# EAGLE design ESPArmedButton-1.0 (EAGLE 9.2.2)
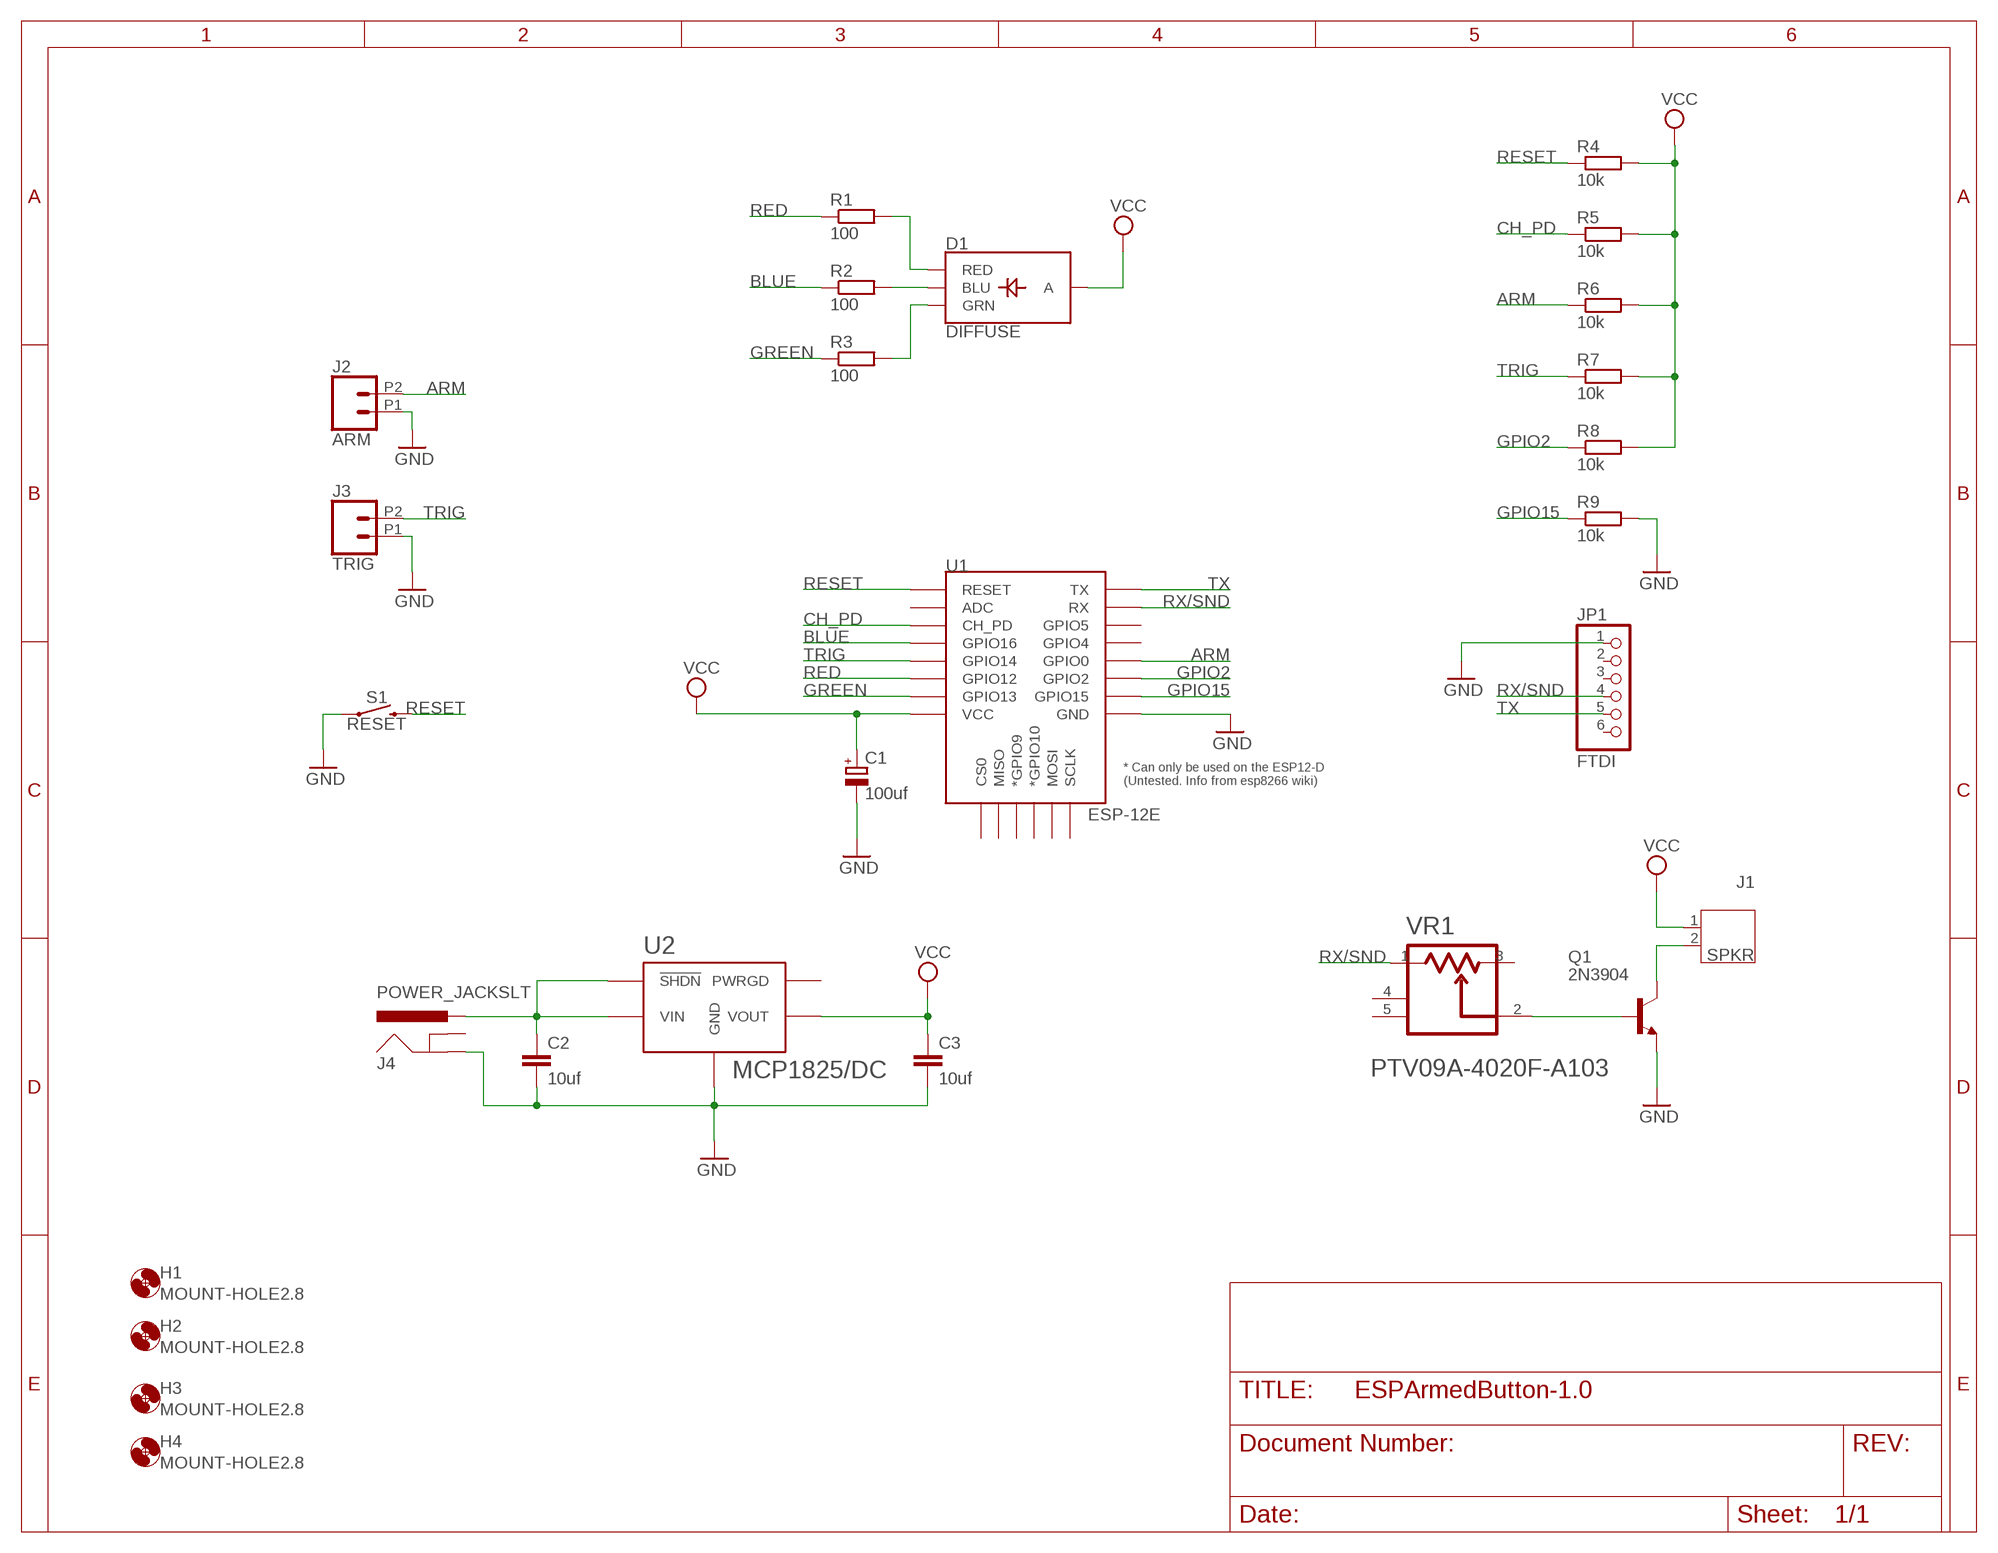
[diagram p0: schematic, sheet 1]

## Parts
C1  100uf  CPOL-EUE2-5  [E2-5]
C2  10uf  C-EU050-025X075  [C050-025X075]
C3  10uf  C-EU050-025X075  [C050-025X075]
D1  DIFFUSE  LED-RGB-CADIFFUSE  [LED-RGB-THRU]
H1  MOUNT-HOLE2.8  [2,8]
H2  MOUNT-HOLE2.8  [2,8]
H3  MOUNT-HOLE2.8  [2,8]
H4  MOUNT-HOLE2.8  [2,8]
J1  SPKR  JST-PH2  [JST-PH2]
J2  ARM  CONN_022.54MM_SCREWTERM  [1X02_2.54_SCREWTERM]
J3  TRIG  CONN_022.54MM_SCREWTERM  [1X02_2.54_SCREWTERM]
J4  POWER_JACKSLT  [POWER_JACK_SLOT]
JP1  FTDI  PINHD-1X6/90  [1X06/90]
Q1  2N3904  [TO92]
R1  100  R-EU_0207/7  [0207/7]
R2  100  R-EU_0207/7  [0207/7]
R3  100  R-EU_0207/7  [0207/7]
R4  10k  R-EU_0207/7  [0207/7]
R5  10k  R-EU_0207/7  [0207/7]
R6  10k  R-EU_0207/7  [0207/7]
R7  10k  R-EU_0207/7  [0207/7]
R8  10k  R-EU_0207/7  [0207/7]
R9  10k  R-EU_0207/7  [0207/7]
S1  RESET  MOMENTARY-SWITCH-SPST-PTH-6.0MM  [TACTILE_SWITCH_PTH_6.0MM]
U1  ESP-12E  ESP12ESMD  [ESP12E-SMD]
U2  MCP1825/DC  [SOT-223-5]
VR1  BOURNS_PTV09A-4020F-A103BOURNS_PTV09A-4020F-A103_0_0  [BOURNS_PTV09A-4020F-A103_0]

## Nets
ARM: J2.P2 R6.1 U1.GPIO0
BLUE: R2.1 U1.GPIO16
CH_PD: R5.1 U1.CH_PD
GND [power]: C1.- C2.2 C3.2 J2.P1 J3.P1 J4.GND@1(GND) JP1.1 Q1.3(E) R9.2 S1.1 U1.GND U2.P$3(GND) U2.P$6(GND)
GPIO2: R8.1 U1.GPIO2
GPIO15: R9.1 U1.GPIO15
GREEN: R3.1 U1.GPIO13
N$4: Q1.2(B) VR1.2
N$5: J1.2 Q1.1(C)
N$6: D1.4(BLU) R2.2
N$7: D1.1(RED) R1.2
N$8: D1.3(GRN) R3.2
RED: R1.1 U1.GPIO12
RESET: R4.1 S1.3 U1.RESET
RX/SND: JP1.4 U1.RXD0(RX) VR1.1
TRIG: J3.P2 R7.1 U1.GPIO14
TX: JP1.5 U1.TXD0(TX)
VCC [power]: C1.+ C3.1 D1.2(A) J1.1 R4.2 R5.2 R6.2 R7.2 R8.2 U1.VCC U2.P$4(VOUT)
VIN [power]: C2.1 J4.PWR U2.P$1(!SHDN) U2.P$2(VIN)
Unconnected: J4.GND@2(GNDBREAK) JP1.2 JP1.3 JP1.6 U1.ADC U1.CS0 U1.GPIO4 U1.GPIO5 U1.GPIO9(*GPIO9) U1.GPIO10(*GPIO10) U1.MISO U1.MOSI U1.SCLK U2.P$5(PWRGD) VR1.3 VR1.4(MNT_1) VR1.5(MNT_2)

## Library data of the parts
C1 = resistor:CPOL-EU: POLARIZED CAPACITOR, European symbol
C2 C3 = rcl:C-EU: CAPACITOR, European symbol; SPICEPREFIX: C
D1 = LED:LED-RGB-CA: LED-RGB Diffused Common Anode Packages: LED RGB-THRU P-LCC-4-3 LED-TRICOLOR-SMD SparkFun Products: RGB Diffused Common Anode- Diffuse <[https://www.sparkfun.com/products/10821]> RGB Diffused Common Anode - Clear <[https://www.sparkfun.com/products/10820]> Qduino Mini <[https://www.sparkfun.com/products/13614]> Triple Output LED RGB - SMD <https://www.sparkfun.com/products/7844>; PROD_ID: DIO-10632
H1-H4 = holes:MOUNT-HOLE: MOUNTING HOLE with drill center marker
J1 = jst-ph:JST-PH2
J2 J3 = SparkFun-Connectors:CONN_02: Multi connection point. Often used as Generic Header-pin footprint for 0.1 inch spaced/style header connections On any of the 0.1 inch spaced packages, you can populate with these: Break Away Headers - Straight <https://www.sparkfun.com/products/116> (PRT-00116) Break Away Male Headers - Right Angle <https://www.sparkfun.com/products/553> (PRT-00553) Female Headers <https://www.sparkfun.com/products/115> (PRT-00115) Break Away Headers - Machine Pin <https://www.sparkfun.com/products/117> (PRT-00117) Break Away Female Headers - Swiss Machine Pin <https://www.sparkfun.com/products/743> (PRT-00743) For SCREWTERMINALS and SPRING TERMINALS visit here: Screw Terimnals on SparkFun.com <https://www.sparkfun.com/search/results?term=Screw+Terminals> (5mm/3.5mm/2.54mm spacing) This device is also useful as a general connection point to wire up your design to another part of your project. Our various solder wires solder well into these plated through hole pads. Hook-Up Wire - Assortment (Stranded, 22 AWG) <https://www.sparkfun.com/products/11375> (PRT-11375) Hook-Up Wire - Assortment (Solid Core, 22 AWG) <https://www.sparkfun.com/products/11367> (PRT-11367) View the entire wire category on our website here <https://www.sparkfun.com/categories/141> Special notes: Molex polarized connector foot print use with: PRT-08233 with associated crimp pins and housings. 2.54_SCREWTERM for use with PRT-10571. 3.5mm Screw Terminal footprints for PRT-08084 5mm Screw Terminal footprints for use with PRT-08432
J4 = powerjack:POWER_JACK: Power Jack Connector This is the standard 5.5mm barrel jack for power. The PTH is the most common, proven, reliable, footprint. The Slot footprint only works if the mill layer is transmitted to the PCB fab house so be warned. Here are the connectors we sell at SparkFun: DC Barrel Power Jack/Connector <https://www.sparkfun.com/products/119> (PRT-00119) DC Barrel Power Jack/Connector (SMD) <https://www.sparkfun.com/products/12748> (PRT-12748) DC Barrel Jack Adapter - Breadboard Compatible <https://www.sparkfun.com/products/10811> (PRT-10811) It is used on this SparkFun product (and many, many others): SparkFun RedBoard - Programmed with Arduino <https://www.sparkfun.com/products/12757> (DEV-12757) Also, if you need a mating power supply or connector, please check these out: Wall Adapter Power Supply - 9VDC 650mA <https://www.sparkfun.com/products/298> (TOL-00298) DC Barrel Jack Adapter - Male <https://www.sparkfun.com/products/10287> (PRT-10287); PROD_ID: PRT-00119
JP1 = pinhead:PINHD-1X6: PIN HEADER
Q1 = transistor-npn:2N3904: NPN Transistor
R1-R9 = resistor:R-EU_: RESISTOR, European symbol
S1 = switches:MOMENTARY-SWITCH-SPST: Momentary Switch (Pushbutton) - SPST Normally-open (NO) SPST momentary switches (buttons, pushbuttons). Variants PTH-12MM - 12mm square, through-hole Momentary Pushbutton Switch - 12mm Square <https://www.sparkfun.com/products/9190> (COM-09190) PTH-6.0MM, PTH-6.0MM-KIT - 6.0mm square, through-hole Mini Pushbutton Switch <https://www.sparkfun.com/products/97> (COM-00097) KIT package intended for soldering kit's - only one side of pads' copper is exposed. PTH-RIGHT-ANGLE-KIT - Right-angle, through-hole Right Angle Tactile Button <https://www.sparkfun.com/products/10791> - Used on SparkFun BigTime Watch Kit <https://www.sparkfun.com/products/11734> SMD-12MM - 12mm square, surface-mount Tactile Button - SMD (12mm) <https://www.sparkfun.com/products/12993> (COM-12993) Used on SparkFun PicoBoard <https://www.sparkfun.com/products/11888> SMD-4.5MM - 4.5mm Square Trackball Switch Used on SparkFun Blackberry Trackballer Breakout <https://www.sparkfun.com/products/13169> SMD-4.6MMX2.8MM - 4.60mm x 2.80mm, surface mount Used on SparkFun SAMD21 Mini Breakout <https://www.sparkfun.com/products/13664> SMD-5.2MM, SMD-5.2-REDUNDANT - 5.2mm square, surface-mount Mini Pushbutton Switch - SMD <https://www.sparkfun.com/products/8720> (COM-08720) Used on Arduino Pro Mini <https://www.sparkfun.com/products/11114> REDUNDANT package connects both switch circuits together SMD-6.0X3.5MM - 6.0 x 3.5mm, surface mount Momentary Reset Switch SMD <https://www.sparkfun.com/products/8229> (COM-08229) SMD-6.2MM-TALL - 6.2mm square, surface mount Tactile Button - SMD (6mm) <https://www.sparkfun.com/products/12992> Used on SparkFun Digital Sandbox <https://www.sparkfun.com/products/12651> SMD-RIGHT-ANGLE - Right-angle, surface mount Used on SparkFun Block for Intel® Edison - Arduino <https://www.sparkfun.com/products/13036>; PROD_ID: SWCH-08441; SF_SKU: COM-00097
U1 = ESP8266:ESP12E: ESP12E Module
U2 = voltagereg:MCP1825/DC
VR1 = bourns:BOURNS_PTV09A-4020F-A103: PTV09 series 9mm Potentiometer; CENTROID_NOT_SPECIFIED: No; DATASHEET: http://www.bourns.com/data/global/pdfs/PTV09.pdf; DIGIKEY_DESCRIPTION: RES POT 10K OHM 1/20W CARBON LOG; DIGIKEY_PART_NUMBER: PTV09A-4020F-A103-ND; LEAD_FREE: yes; MF: Bourns; MFG_PACKAGE_IDENT: PTV09A-4; MOUSER_PART_NUMBER: 652-PTV09A-4020FA103; MPN: PTV09A-4020F-A103; PACKAGE: POT_PTH_9MMO; POWER: 50mW; PREFIX: VR; RESISTANCE: 10k; ROHS: yes; TEMPERATURE_RANGE_HIGH: +50°C; TEMPERATURE_RANGE_LOW: -10°C

## Net classes
1 power: width 0.508 mm

## Board
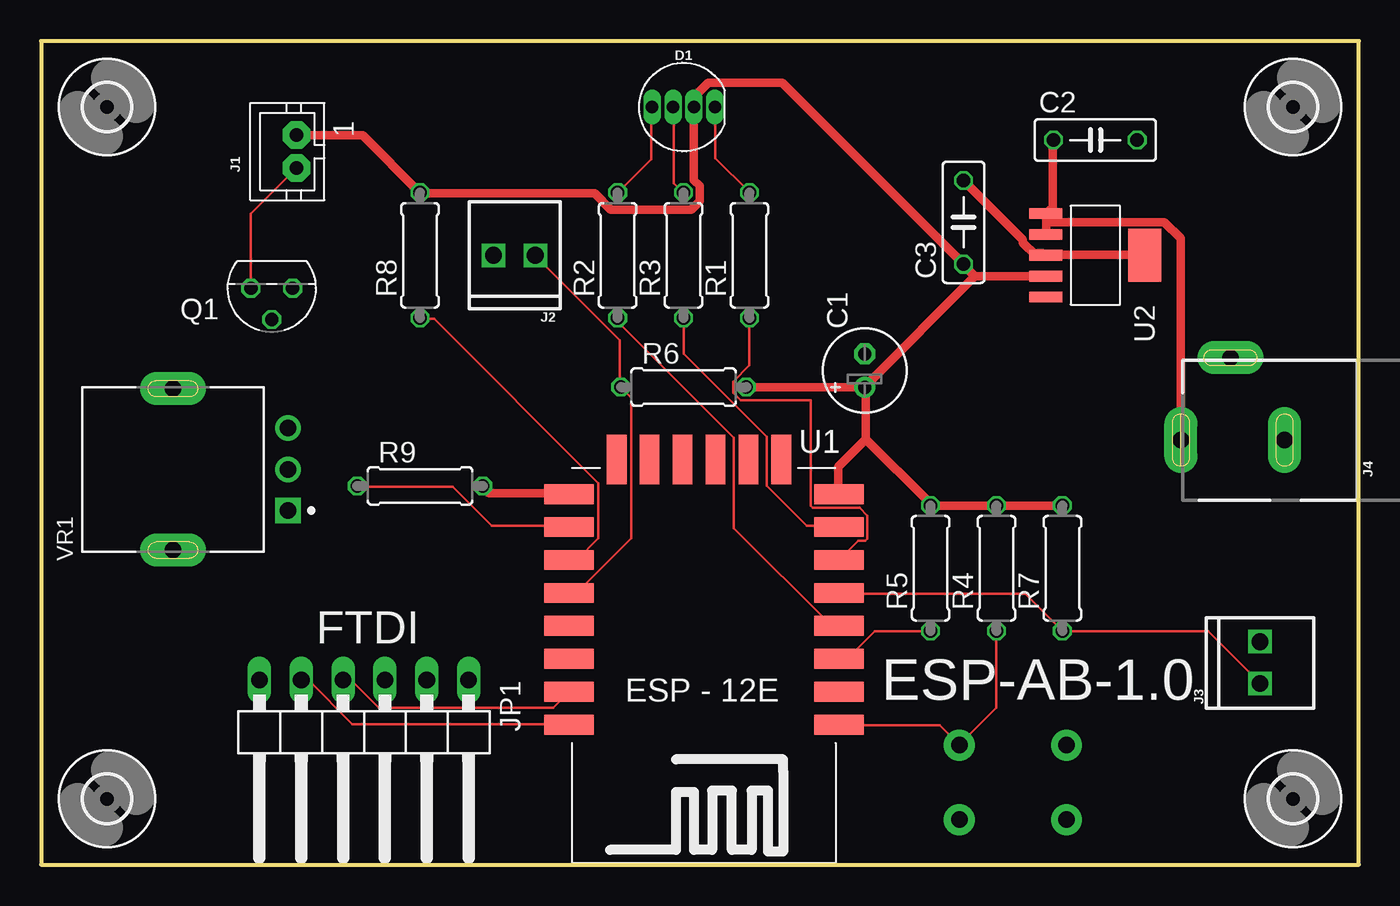
[diagram p1: board, top side]
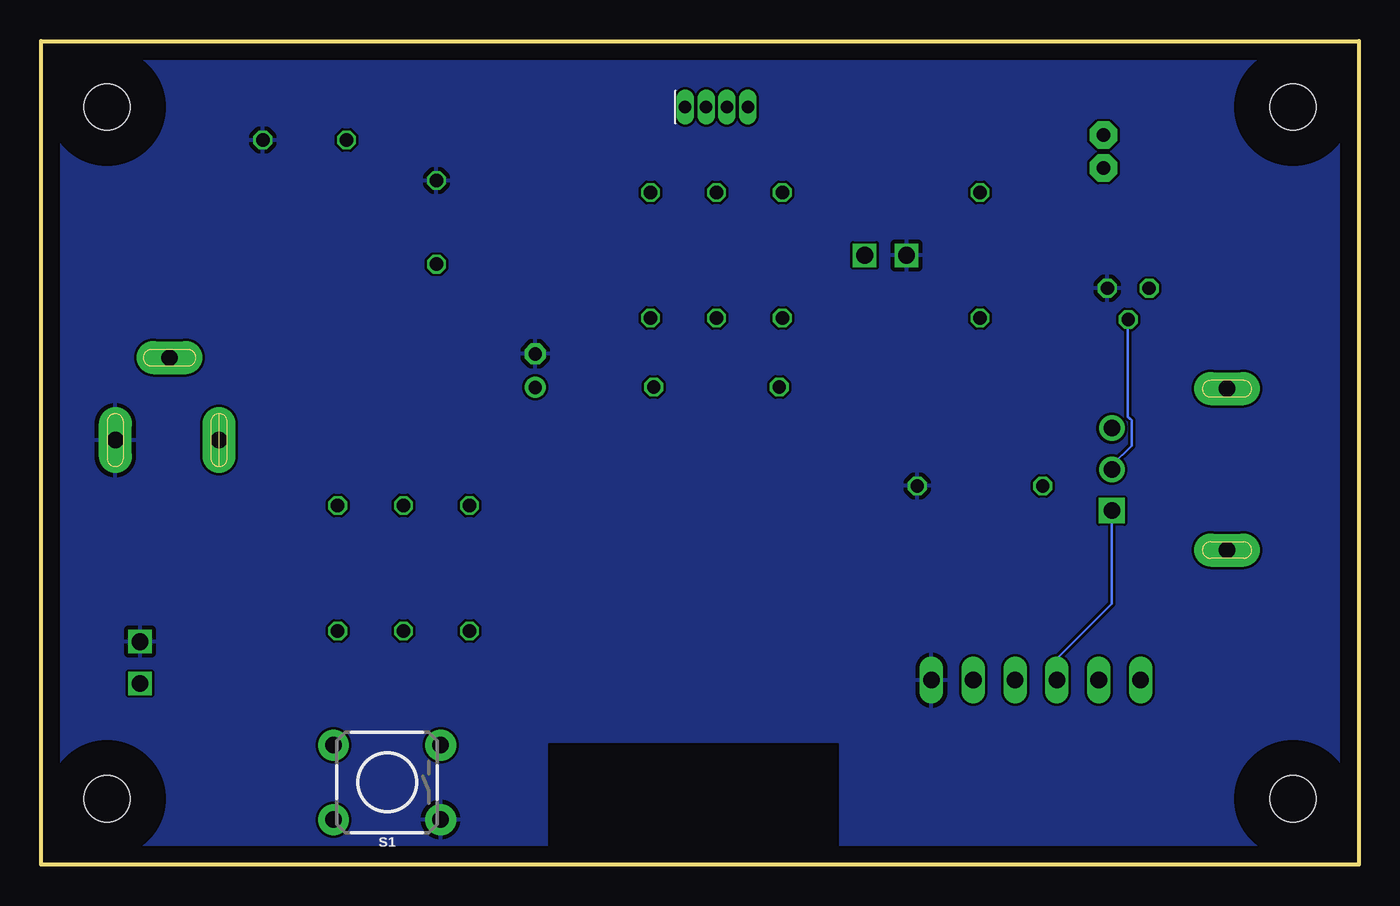
[diagram p2: board, bottom side, seen from below]

Size 80 x 50 mm. Coordinates in mm from the lower left corner, seen from the top.
Outline: 0,50 0,0 80,0 80,50 0,50
Copper layers (1*16): Top 0.035mm / dielectric 1.6mm / Bottom 0.035mm
Design rules "default *": minimum track width 6mil, minimum drill 0.35mm, track to track 6mil, track to pad 6mil, pad to pad 6mil, via to via 6mil, smd to smd 6mil, copper to edge 40mil, drill to drill 6mil, minimum pad ring 5mil, minimum via ring 8mil, stop-mask expansion 4mil, vias tented up to drill 0mil, thermal gap 10mil

### Footprints (pad centres in the part's own frame; a part is rotated, then mirrored left to right if it is on the bottom)
E2-5 = drill 0.813 pad 1.27: + -1.016,0 | drill 0.813 pad 1.27 octagon: - 1.016,0
C050-025X075 = drill 0.813 octagon: 1 -2.54,0; 2 2.54,0
LED-RGB-THRU = drill 0.762 pad 0.889 long: 1 1.905,0; 2 0.635,0; 3 -0.635,0; 4 -1.905,0
2,8 = hole 2.8: 0,0
JST-PH2 = drill 0.813 pad 1.676 octagon: 1 1,0; 2 -1,0
1X02_2.54_SCREWTERM = drill 1.016 square: P1 2.54,0; P2 0,0
POWER_JACK_SLOT = drill 1 pad 2 long: GND@1 2.58,7.5; GND@2 7.58,10.8; PWR 2.58,13.8
1X06/90 = drill 1.016 long: 1 -6.35,-3.81; 2 -3.81,-3.81; 3 -1.27,-3.81; 4 1.27,-3.81; 5 3.81,-3.81; 6 6.35,-3.81
TO92 = drill 0.813 octagon: 1 1.27,0; 2 0,1.905; 3 -1.27,0
0207/7 = drill 0.813 octagon: 1 -3.81,0; 2 3.81,0
TACTILE_SWITCH_PTH_6.0MM = drill 1.016 pad 1.88: 1 -3.251,2.261; 2 3.251,2.261; 3 -3.251,-2.261; 4 3.251,-2.261
ESP12E-SMD = smd 3 x 1.2: ADC -8.3,3.8; CH_PD -8.3,1.8; GND 8.1,-8.2; GPIO0 8.1,-2.2; GPIO2 8.1,-4.2; GPIO4 8.1,-0.2; GPIO5 8.1,1.8; GPIO12 -8.3,-4.2; GPIO13 -8.3,-6.2; GPIO14 -8.3,-2.2; GPIO15 8.1,-6.2; GPIO16 -8.3,-0.2; RESET -8.3,5.8; RXD0 8.1,3.8; TXD0 8.1,5.8; VCC -8.3,-8.2 | smd 1.2 x 3: CS0 -4.8,-10.3; GPIO9 -0.8,-10.3; GPIO10 1.2,-10.3; MISO -2.8,-10.3; MOSI 3.2,-10.3; SCLK 5.2,-10.3
SOT-223-5 = smd 0.65 x 2: P$1 -2.54,-2; P$2 -1.27,-2; P$3 0,-2; P$4 1.27,-2; P$5 2.54,-2 | smd 3.2 x 2: P$6 0,4
BOURNS_PTV09A-4020F-A103_0 = drill 1 pad 1.55 square: 1 -2.5,-7 | drill 1 pad 1.55: 2 0,-7; 3 2.5,-7 | drill 1 pad 2 long: 4 -4.9,0; 5 4.9,0

### Placement (x,y rotation side)
C1  50,30 90 top
C2  64,44 0 top
C3  56,39 90 top
D1  39,46 0 top
H1  4,4 0 top
H2  4,46 0 top
H3  76,46 0 top
H4  76,4 0 top
J1  15.5,43.3 90 top
J2  30,37 180 top
J3  74,11 90 top
J4  83,23.2 90 top
JP1  19.6,7.4 180 top
Q1  14,35 180 top
R1  43,37 90 top
R2  35,37 90 top
R3  39,37 90 top
R4  58,18 90 top
R5  54,18 90 top
R6  39,29 0 top
R7  62,18 90 top
R8  23,37 90 top
R9  23,23 0 top
S1  59,5 180 bottom
U1  40.14,14.3 180 top
U2  63,37 270 top
VR1  8,24 90 top

### Tracks (layer width: path | path; a pad name or v marks a point on that pad's centre or on a via)
ARM
  Top 0.152: J2.P2 30.02,36.96 35.13,31.85 35.13,29.03 R6.1 35.2,28.96 35.81,28.35 35.81,19.81 32.54,16.54 32.08,16.54 U1.GPIO0
BLUE
  Top 0.152: R2.1 35.05,33.15 35.05,32.92 42.06,25.91 42.06,20.42 47.93,14.55 48.39,14.55 U1.GPIO16
CH_PD
  Top 0.152: R5.1 53.95,14.17 50.6,14.17 49,12.57 48.46,12.57 U1.CH_PD
GND
  Top 0.508: U1.GND 32,22.55 27.2,22.55 26.82,22.94 R9.2 | U2.P$3 61.04,37.03 66.98,37.03 U2.P$6 | 60.2,37.11 60.81,37.11 U2.P$3 | C3.2 59.59,37.95 59.59,37.78 60.37,37 U2.P$3
  pour Bottom: 80,0 0,0 0,50 80,50
GPIO2
  Top 0.152: R8.1 23.01,33.15 23.85,33.15 33.83,23.16 33.83,19.81 32.54,18.52 32.08,18.52 U1.GPIO2
GPIO15
  Top 0.152: R9.1 19.2,22.94 24.99,22.94 27.36,20.57 32,20.57 U1.GPIO15
GREEN
  Top 0.152: R3.1 39.01,33.15 39.01,31.01 44.04,25.98 44.04,23.01 46.48,20.57 48.39,20.57 U1.GPIO13
N$4
  Bottom 0.152: Q1.2 14.02,33.07 14.02,27.2 13.79,26.98 13.79,25.45 14.94,24.31 14.94,24 VR1.2
N$5
  Top 0.152: J1.2 12.73,39.53 Q1.1
N$6
  Top 0.152: D1.4 37.03,45.95 37.03,42.82 35.05,40.84 R2.2
N$7
  Top 0.152: D1.1 40.92,45.95 40.92,42.9 42.98,40.84 R1.2
N$8
  Top 0.152: D1.3 38.41,45.95 38.41,41.38 38.94,40.84 R3.2
RED
  Top 0.152: U1.GPIO12 49.61,19.67 50.03,19.67 50.17,19.8 50.17,21.2 49.69,21.67 46.84,21.67 46.71,21.8 46.71,28.2 42.48,28.2 42.01,28.67 42.01,29.33 43,30.32 R1.1
RESET
  Top 0.152: R4.1 57.99,14.17 57.99,9.53 55.78,7.32 S1.3 55.7,7.32 54.56,8.46 48.46,8.46 U1.RESET
RX/SND
  Top 0.152: JP1.4 18.36,11.2 18.82,11.2 20.5,9.53 31.09,9.53 32,10.44 U1.RXD0
  Bottom 0.152: VR1.1 15.01,21.49 15.01,15.85 18.29,12.57 18.29,11.28 JP1.4
TRIG
  Top 0.152: J3.P2 73.99,11.05 70.87,14.17 62.03,14.17 R7.1 61.95,14.25 59.74,16.46 48.46,16.46 U1.GPIO14
TX
  Top 0.152: JP1.5 15.85,11.2 16.23,11.2 18.9,8.53 32,8.53 U1.TXD0
VCC
  Top 0.508: 56.69,35.74 60.96,35.74 U2.P$4 | 56.69,35.74 56.01,36.42 C3.1 44.99,47.47 40.52,47.47 39.66,46.62 39.66,46.03 D1.2 39.63,41.55 39.98,41.21 39.98,40.28 39.47,39.78 34.59,39.78 33.6,40.77 23.01,40.77 R8.2 19.51,44.3 J1.1 | R7.2 61.95,21.79 58.22,21.79 R4.2 57.99,21.79 54.03,21.79 R5.2 53.87,22.02 50.06,25.83 | 50.06,25.83 50.06,28.96 C1.+ | 56.69,35.74 50.14,29.18 C1.+ | U1.VCC 48.39,22.55 48.39,24.16 50.06,25.83 | R6.2 43.05,28.96 43.08,28.98 C1.+
VIN
  Top 0.508: 61.04,39.01 61.04,39.47 U2.P$1 61.19,39.7 61.42,39.93 61.42,43.97 C2.1 | 61.04,39.01 61.04,38.33 U2.P$2 | 61.04,39.01 68.2,39.01 69.19,38.02 69.19,25.83 J4.PWR

### Text on the board
tNames: ESP-AB-1.0